# EasyEDA Pro project ProPrj_iamge v2_2026-08-18.epro, board PCB4
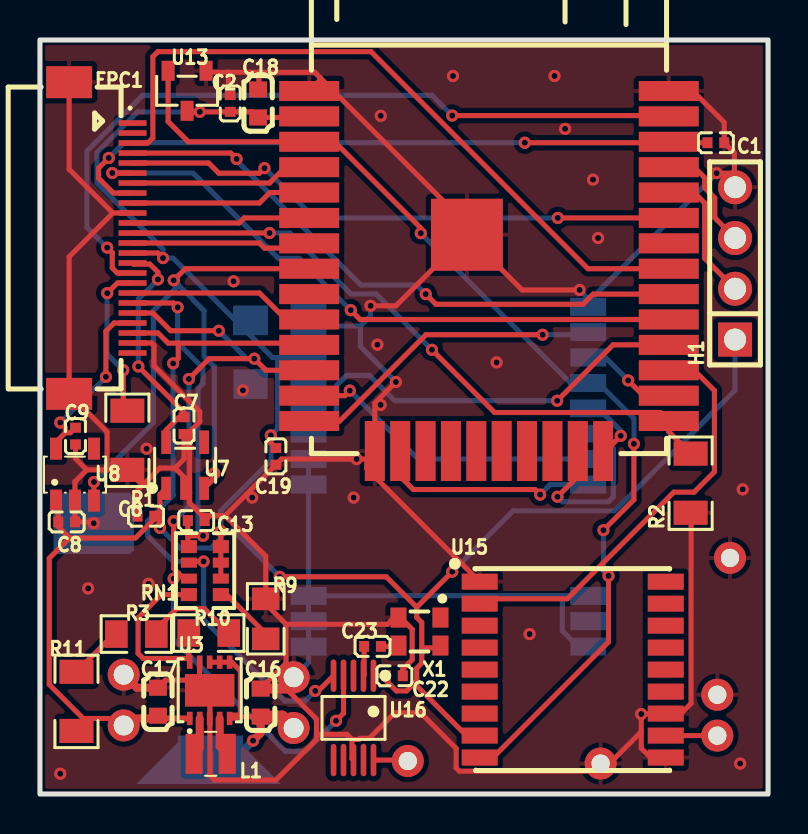
[diagram p2: board, top side]
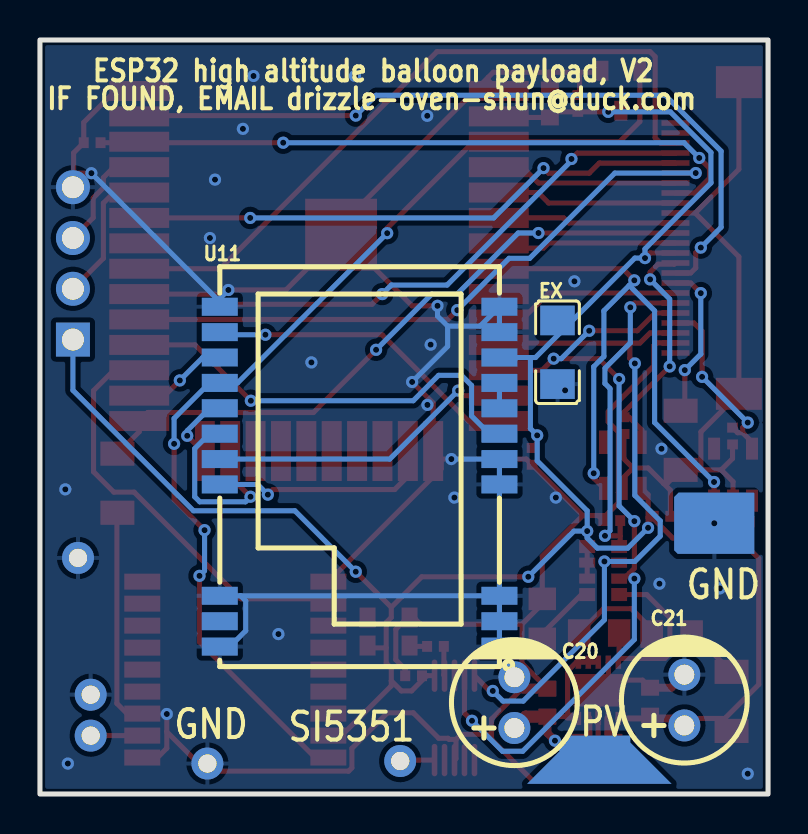
[diagram p3: board, bottom side, seen from below]

Outline 36.45 x 37.72 mm; copper layers: Top Layer, Bottom Layer. Coordinates in mm from the lower left corner of the outline.
Outline path: rectangle 0,37.72 36.45,0
Stack: Top Layer 0.035mm / Dielectric1 1.51mm FR4 er 4.5 / Bottom Layer 0.035mm

## Design rules (mm)
template: JLCPCB Capability(Two Layers Board)
spacing copperThickness1oz (default): track to track 0.102, other pairs 0.152 to 0.3
spacing copperThickness2oz: track to track 0.203, other pairs 0.152 to 0.3
track width copperThickness1oz (default): min 0.127, default 0.254, max 2.54
track width copperThickness2oz: min 0.203, default 0.254, max 2.54
differential pair differentialPair (default): width min 0.127, default 0.254, max 2.54; gap min 0.152, default 0.152
via viaSize (default): diameter min 0.5, default 0.61, max 10; hole min 0.3, default 0.305, max 6.3

## Placement (name value [footprint] x y rotation side)
C1  15pF  [C0402]  33.84 32.58 180 top
C2  100nF  [C0402]  9.53 34.54 270 top
C6  1uF  [C0402]  5.31 13.9 0 top
C7  1uF  [C0402]  7.21 18.43 90 top
C8  1uF  [C0402]  1.34 13.61 180 top
C9  1uF  [C0402]  1.78 17.91 90 top
C13  100nF  [C0402]  7.82 13.68 0 top
C16  10uF  [C0603]  11.05 4.57 270 top
C17  10uF  [C0603]  5.91 4.62 270 top
C18  10uF  [C0603]  10.92 34.54 270 top
C19  1uF  [C0402]  11.81 16.89 270 top
C20  1000uF  [CAP-TH_BD6.3-P2.50-D1.0-FD]  12.7 4.57 90 bottom
C21  1000uF  [CAP-TH_BD6.3-P2.50-D1.0-FD]  4.19 4.7 90 bottom
C22  1uF  [C0402]  17.74 5.92 0 top
C23  100nF  [C0402]  16.65 7.38 180 top
EX  EX  [C1206]  10.54 22.1 270 bottom
FPC1  FH12-24S-0.5SH(55)  [FPC-SMD_FH12-24S-0.5SH-55]  3.05 27.81 90 top
H1  PZ254V-11-04P  [HDR-TH_4P-P2.54-V-M]  34.8 26.54 90 top
L1  4.7uH  [IND-SMD_L2.5-W2.0-VLS252012CX-150M]  8.55 2.01 180 top
NOREF  -  [Pad_e340]  18.41 1.65 0 top
NOREF#2  -  [Pad_e1166]  33.91 2.92 0 top
NOREF#3  -  [Pad_e701]  28.07 1.52 0 top
NOREF#4  -  [Pad_e1167]  33.91 4.97 0 top
NOREF#5  -  [Pad_e1445]  34.54 11.81 0 top
NOREF#6  -  [Pad_e27518]  8.45 1.71 0 top
NOREF#7  -  [Pad_e27528]  2.69 13.54 0 top
R1  1kΩ  [R1206]  4.38 17.69 90 top
R2  1kΩ  [R1206]  32.57 15.55 90 top
R3  16kΩ  [R0805]  4.83 8 180 top
R9  82kΩ  [R0805]  11.3 8.76 90 top
R10  470kΩ  [R0805]  8.45 8.05 0 top
R11  1kΩ  [R1206]  1.83 4.63 270 top
RN1  4.7kΩ  [RES-ARRAY-SMD_0603-8P-L3.2-W1.6-BL]  8.25 11.18 270 top
U1  2.4GHz  [WIRELM-SMD_ESP32-S]  22.48 26.16 0 top
U3  RT6150AGQW  [WDFN-10_L3.0-W3.0-P0.50-BL-EP]  8.5 5.19 0 top
U7  ME6211C12M5G-N  [SOT-23-5_L3.0-W1.7-P0.95-LS2.8-BL]  7.27 16.44 0 top
U8  ME6211C28M5G-N  [SOT-23-5_L3.0-W1.7-P0.95-LS2.8-BR]  1.75 15.98 270 top
U11  E22-900M22S  [WIRELM-SMD_E22-900M22S]  20.45 15.88 180 bottom
U13  MAX809STRG-TP  [SOT-23-3_L2.9-W1.3-P1.90-LS2.4-BR]  7.37 35.18 90 top
U15  ATGM336H-5NR32  [GPS-SMD_18P-L10.1-W9.7-P1.10-TL]  26.67 6.22 0 top
U16  SI5351A-B-GTR  [MSOP-10_L3.0-W3.0-P0.50-LS5.0-BL]  15.7 3.81 180 top
X1  26MHz  [OSC-SMD_4P-L2.5-W2.0-BL_X1G0042110003]  19 8.13 180 top

## Footprints (pads in the part's own frame, mm; a bottom-side part is the same pattern mirrored in y, then rotated)
C0402
  rect 0.5x0.54 smd: 1(-0.42,0) 2(0.42,0)
C0603
  rect 0.8x0.9 smd: 1(-0.7,0) 2(0.7,0)
C1206
  rect 1.485x1.728 smd: 1(-1.593,0) 2(1.593,0)
CAP-TH_BD6.3-P2.50-D1.0-FD
  round 1.6 hole 1: 1(-1.27,0) 2(1.27,0)
FPC-SMD_FH12-24S-0.5SH-55
  rect 0.28x1.4 smd: 1(5.75,-1.588) 2(5.25,-1.588) 3(4.75,-1.588) 4(4.25,-1.588) 5(3.751,-1.588) 6(3.25,-1.588) 7(2.751,-1.588) 8(2.251,-1.588) 9(1.75,-1.588) 10(1.25,-1.588) 11(0.75,-1.588) 12(0.25,-1.588) 13(-0.25,-1.588) 14(-0.75,-1.588) 15(-1.25,-1.588) 16(-1.75,-1.588) 17(-2.25,-1.588) 18(-2.75,-1.588) 19(-3.25,-1.588) 20(-3.75,-1.588) 21(-4.25,-1.588) 22(-4.75,-1.588) 23(-5.25,-1.588) 24(-5.75,-1.588)
  rect 1.6x2.3 smd: 25(7.795,1.588) 26(-7.795,1.588)
GPS-SMD_18P-L10.1-W9.7-P1.10-TL
  rect 1.8x0.8 smd: 1(-4.657,4.4) 2(-4.657,3.3) 3(-4.657,2.2) 4(-4.657,1.1) 5(-4.657,0) 6(-4.657,-1.1) 7(-4.657,-2.2) 8(-4.657,-3.3) 9(-4.657,-4.4) 10(4.657,-4.4) 11(4.657,-3.3) 12(4.657,-2.2) 13(4.657,-1.1) 14(4.657,0) 15(4.657,1.1) 16(4.657,2.2) 17(4.657,3.3) 18(4.657,4.4)
HDR-TH_4P-P2.54-V-M
  rect 1.7x1.7 hole 1.1: 1(-3.81,0)
  round 1.7 hole 1.1: 2(-1.27,0) 3(1.27,0) 4(3.81,0)
IND-SMD_L2.5-W2.0-VLS252012CX-150M
  rect 0.85x2 smd: 1(-0.83,0) 2(0.83,0)
MSOP-10_L3.0-W3.0-P0.50-LS5.0-BL
  oval 0.28x1.62 smd: 1(-1,-2.11) 2(-0.5,-2.11) 3(0,-2.11) 4(0.5,-2.11) 5(1,-2.11) 6(1,2.11) 7(0.5,2.11) 8(0,2.11) 9(-0.5,2.11) 10(-1,2.11)
OSC-SMD_4P-L2.5-W2.0-BL_X1G0042110003
  rect 0.8x1 smd: 1(-1.05,-0.7) 2(1.05,-0.7) 3(1.05,0.7) 4(-1.05,0.7)
Pad_e340
  round 1.6 hole 0.914: 1(0,0)
Pad_e701
  round 1.6 hole 0.914: 1(0,0)
Pad_e1166
  round 1.6 hole 0.914: 1(0,0)
Pad_e1167
  round 1.6 hole 0.914: 2(0,0)
Pad_e1445
  round 1.6 hole 0.914: 2(0,0)
Pad_e27518
  custom 7.239x2.413 smd far side: 41(0,0)
Pad_e27528
  custom 4.014x3.064 smd far side: 42(0,0)
R0805
  rect 1.133x1.377 smd: 1(-1,0) 2(1,0)
R1206
  rect 1.208x1.701 smd: 1(-1.479,0) 2(1.479,0)
RES-ARRAY-SMD_0603-8P-L3.2-W1.6-BL
  rect 0.65x0.8 smd: 1(-1.2,-0.8) 4(1.2,-0.8) 5(1.2,0.8) 8(-1.2,0.8)
  rect 0.5x0.8 smd: 2(-0.4,-0.8) 3(0.4,-0.8) 6(0.4,0.8) 7(-0.4,0.8)
SOT-23-3_L2.9-W1.3-P1.90-LS2.4-BR
  rect 1x0.65 smd: 1(1,-0.95) 2(1,0.95) 3(-1,0)
SOT-23-5_L3.0-W1.7-P0.95-LS2.8-BL
  rect 0.49x1.157 smd: 1(-0.95,-1.153) 2(0,-1.153) 3(0.95,-1.153)
  rect 0.49x1.175 smd: 4(0.95,1.153) 5(-0.95,1.153)
SOT-23-5_L3.0-W1.7-P0.95-LS2.8-BR
  rect 1.1x0.6 smd: 1(1.3,-0.95) 2(1.3,0) 3(1.3,0.95) 4(-1.3,0.95) 5(-1.3,-0.95)
WDFN-10_L3.0-W3.0-P0.50-BL-EP
  rect 0.28x0.665 smd: 1(-1,-1.407) 2(-0.5,-1.407) 3(0,-1.407) 4(0.5,-1.407) 5(1,-1.407) 6(1,1.407) 7(0.5,1.407) 8(0,1.407) 9(-0.5,1.407) 10(-1,1.407)
  rect 2.475x1.625 smd: 11(0,0)
WIRELM-SMD_E22-900M22S
  rect 1.8x0.9 smd: 1(7,-8.5) 2(7,-7.23) 3(7,-5.96) 4(7,-0.39) 5(7,0.88) 6(7,2.15) 7(7,3.42) 8(7,4.69) 9(7,5.96) 10(7,7.23) 11(7,8.5) 12(-7,8.5) 13(-7,7.23) 14(-7,5.96) 15(-7,4.69) 16(-7,3.42) 17(-7,2.15) 18(-7,0.88) 19(-7,-0.39) 20(-7,-5.96) 21(-7,-7.23) 22(-7,-8.5)
WIRELM-SMD_ESP32-S
  rect 3x1 smd: 1(-9,9.005) 2(-9,7.735) 3(-9,6.465) 4(-9,5.195) 5(-9,3.925) 6(-9,2.655) 7(-9,1.385) 8(-9,0.115) 9(-9,-1.155) 10(-9,-2.425) 11(-9,-3.695) 12(-9,-4.965) 13(-9,-6.235) 14(-9,-7.505) 25(9,-7.505) 26(9,-6.235) 27(9,-4.965) 28(9,-3.695) 29(9,-2.425) 30(9,-1.155) 31(9,0.115) 32(9,1.385) 33(9,2.655) 34(9,3.925) 35(9,5.195) 36(9,6.465) 37(9,7.735) 38(9,9.005)
  rect 1x3 smd: 15(-5.715,-9.005) 16(-4.445,-9.005) 17(-3.175,-9.005) 18(-1.905,-9.005) 19(-0.635,-9.005) 20(0.635,-9.005) 21(1.905,-9.005) 22(3.175,-9.005) 23(4.445,-9.005) 24(5.715,-9.005)
  rect 3.6x3.6 smd: 39(-1.105,1.815)

## Nets
As in the schematic, except:
GND: C1.1 C2.1 C6.1 C7.1 C8.1 C9.1 C13.2 C16.1 C17.1 C18.1 C19.2 C20.2 C21.2 C22.2 EX.2 FPC1.10 FPC1.23 FPC1.25 FPC1.26 H1.4 NOREF#3.1 NOREF#4.2 NOREF#5.2 NOREF#7.42 R1.1 R2.1 R9.2 U1.1 U1.15 U1.38 U1.39 U3.3 U3.9 U3.11 U7.2 U8.2 U11.1 U11.2 U11.3 U11.4 U11.5 U11.10 U11.11 U11.12 U11.20 U11.22 U13.1 U15.1 U15.10 U15.12 U16.8 X1.2
GPSANT: NOREF#2.1 U15.11
PV: C16.2 C20.1 NOREF#6.41 U3.5 U3.6 U3.7 U3.8
SI5351A: NOREF.1 U16.10

Pads without a net: FPC1 1 2 24; U1 32; U7 4; U8 4; U15 3 4 5 6 7 13 14 15 16 17 18; U16 3 6 7 9; X1 1

## Via types
v1: diameter 0.61, hole 0.305, Top Layer to Bottom Layer, 78 vias

## Routing (per net, layer and track width the routed paths; a pad name or vN(x,y) marks a point on that pad's centre or on a via; arc(x,y) is an arc through that point)
1.2V: length 11.8
  Top Layer w0.254: v1(5.91,25.74) 5.91,26.1 5.5,26.5 4.69,26.5 FPC1.15 ; 6.32,17.6 6.32,18.21 6.96,18.85 C7.2 7.21,19.1 v1(4.93,21.39)
  Bottom Layer w0.254: v1(5.91,25.74) 4.93,24.76 v1(4.93,21.39)
2.8V: length 9.2
  Top Layer w0.254: 1.27,18.07 1.27,18.33 v1(1.02,18.58) ; 1.27,18.07 1.52,18.07 C9.2 ; 1.27,18.07 0.8,17.61 U8.5 ; v1(3.3,20.87) 3.3,23.15 3.71,23.56 FPC1.21
  Bottom Layer w0.254: v1(1.02,18.58) v1(3.3,20.87)
3.3V: length 119.5
  Top Layer w0.254: 6.01,13.82 6.01,14.98 U7.1 ; 6.01,13.82 5.8,13.82 ; 6.01,13.82 v1(6.01,13.32) ; 5.8,13.82 C6.2 ; 5.8,13.82 4.78,12.81 1.48,12.81 ; U1.2 13.43,33.84 C18.2 10.64,34.12 C2.2 v1(8,34.12) 7.42,34.12 U13.3 ; v1(6.16,26.81) 5.91,27.06 FPC1.14 ; 18.86,5.66 18.86,5.41 21.35,2.92 U15.8 ; 18.86,5.66 18.35,5.16 17.84,5.16 17.08,5.92 ; 18.86,5.66 18.86,6.29 19.12,6.55 19.12,7.31 ; 2.16,3.78 0.47,5.48 0.47,11.79 1.48,12.81 ; 2.16,3.78 2.16,3.49 R11.2 ; 2.16,3.78 4.19,3.78 4.19,3.43 ; v1(11.56,17.94) 11.56,17.56 C19.1 ; RN1.6 RN1.7 RN1.8 v1(9.06,13.15) ; 1.48,12.81 0.92,13.37 C8.2 0.92,14.56 U8.1 ; 18.86,9.34 17.34,10.87 v1(12,10.87) ; 18.86,9.34 v1(20.64,11.12) ; 18.86,9.34 18.86,8.83 19.12,8.58 19.12,7.31 ; 17.08,5.92 C22.1 ; 17.08,5.92 U16.1 ; 5.97,3.78 5.97,3.85 C17.2 ; 19.12,7.31 19.93,7.31 X1.4
  Top Layer w0.3: 5.97,3.78 U3.1
  Top Layer w0.4: 4.19,3.78 5.97,3.78
  Bottom Layer w0.254: v1(8,34.12) 4.89,34.12 2.86,32.09 2.86,30.57 6.16,27.27 v1(6.16,26.81) 6.67,26.81 11.64,21.83 11.9,21.83 ; v1(9.06,13.15) 9.06,14.17 11.56,16.67 v1(11.56,17.94) 11.9,18.28 11.9,21.83 ; v1(9.06,13.15) 9.72,13.15 v1(12,10.87) ; v1(9.06,13.15) 9.06,12.81 8.55,12.3 7.02,12.3 v1(6.01,13.32) ; 11.9,21.83 U11.9 ; H1.1 34.8,20.2 28.77,14.17 23.69,14.17 v1(20.64,11.12)
GND: length 240
  Top Layer w0.254: FPC1.23 5.58,22.56 5.72,22.43 5.72,21.42 8,19.13 8,18.62 7.49,18.11 7.49,15.07 ; U1.1 14.01,35.7 14.01,35.85 ; U13.1 8.39,36.1 9.44,36.1 ; 30.1,3.11 v1(30.1,4) 31.31,4 U15.12 32.09,4.02 32.6,4.53 32.6,14.04 R2.1 ; 30.1,3.11 28.13,1.14 21,1.14 20.83,1.31 20.83,2.28 19.05,4.06 17.76,4.06 16.49,2.79 16.02,2.79 15.97,2.73 15.62,2.73 ; 30.1,3.11 30.1,2.29 30.57,1.82 U15.10 ; 9.27,13.93 11.3,11.9 R9.2 11.3,9.51 12.32,8.49 ; 9.27,13.93 8.51,13.93 ; 9.27,13.93 C19.2 12.09,16.75 v1(15.85,16.75) 16.36,16.75 ; 7.49,15.07 7.49,14.56 8.12,13.93 8.51,13.93 ; 7.49,15.07 U7.2 7.27,15.8 6.76,16.31 ; 12.32,5.27 13.84,3.75 13.84,2.99 ; 13.84,2.99 13.84,2.73 11.81,0.7 8.76,0.7 8.51,0.95 8.51,3.77 ; 13.84,2.99 15.37,2.99 15.62,2.73 ; 8.51,3.77 U3.3 ; 8.51,3.77 8.51,5.17 U3.11 7.99,5.7 ; 14.01,35.85 20.61,29.25 20.61,27.21 ; 14.01,35.85 13.75,36.1 10.96,36.1 ; 3.36,16.21 R1.1 5.04,15.54 5.24,15.54 ; 3.36,16.21 3.36,18.12 FPC1.26 1.46,26.88 3.65,29.06 ; 3.36,16.21 2.34,16.21 ; 5.24,15.54 4.89,15.2 C6.1 ; 5.24,15.54 6,16.31 6.76,16.31 ; 17.87,8.75 17.65,8.75 17.4,8.49 12.32,8.49 ; 17.87,8.75 X1.2 ; 17.87,8.75 18.13,8.75 18.63,8.24 18.63,6.71 18.16,6.24 C22.2 ; 8.51,13.93 C13.2 ; U3.9 7.99,6.59 7.99,5.7 ; C16.1 12.32,6.54 12.32,8.49 ; 1.75,13.61 U8.2 1.75,15.62 2.34,16.21 ; 2.34,16.21 1.78,16.78 C9.1 ; 9.44,36.1 10.96,36.1 ; 9.44,36.1 9.44,35.05 C2.1 ; U1.38 32.69,35.17 34.26,33.6 C1.1 34.76,32.07 34.76,31.06 ; 20.61,27.21 U1.39 24.14,25.21 v1(27.02,25.21) ; 20.61,27.21 17.82,24.42 v1(16.55,24.42) ; 15.62,2.73 15.62,1.77 U16.8 ; 10.96,36.1 10.96,35.28 C18.1 ; 6.76,16.31 7.21,16.76 C7.1 ; C8.1 2.63,13.61 v1(2.69,13.54) ; U15.1 16.36,16.27 16.36,16.75 ; v1(17.82,20.61) 16.76,19.56 U1.15 16.36,16.75 ; 3.65,29.06 FPC1.10 ; 3.65,29.06 1.46,31.25 FPC1.25 ; 7.99,5.7 6.28,5.7 C17.1 ; 34.76,31.06 34.76,30.39 H1.4 ; 34.76,31.06 v1(33.87,31.06)
  Top Layer w0.4: C17.1 4.84,5.32 C21.2
  Top Layer w0.5: C16.1 12.32,5.27
  Bottom Layer w0.254: U11.12 27.52,24.45 27.52,24.71 ; U11.22 26.94,7.38 26.15,8.17 26.15,9.66 26.4,9.91 ; U11.3 U11.4 U11.5 v1(15.85,16.75) ; U11.3 26.4,9.91 ; U11.3 U11.2 U11.1 13.45,6.59 12.7,5.84 ; v1(33.87,31.06) 27.52,24.71 ; 27.52,24.71 v1(27.02,25.21) ; 16.04,23.41 14.42,23.41 U11.11 U11.10 ; 16.04,23.41 16.04,22.39 v1(17.82,20.61) ; 16.04,23.41 16.55,23.91 v1(16.55,24.42) ; 26.4,9.91 U11.20
  vias: v1(1.02,1.02) v1(2.41,10.29) v1(5.33,17.27) v1(5.44,10.52) v1(9.69,25.65) v1(10.16,20.19) v1(10.62,14.83) v1(15.7,14.83) v1(16.89,22.48) v1(17.06,33.93) v1(17.05,19.47) v1(20.68,35.92) v1(22.86,21.59) v1(24.51,8) v1(25.76,35.92) v1(26.29,33.27) v1(27.69,30.73) v1(27.94,27.81) v1(35.05,1.52) v1(35.18,15.24)
CAMPWR: length 31
  Top Layer w0.254: v1(8.73,16.04) 8.73,15.8 U7.3 ; v1(2.7,15.61) 2.7,14.68 ; U1.8 7.28,26.28 v1(6.69,25.7)
  Bottom Layer w0.254: 6.95,25.44 5.68,24.17 5.68,18.58 v1(2.7,15.61) ; 6.95,25.44 v1(6.69,25.7) ; 6.95,25.44 8.22,24.17 8.22,21.89 8.73,21.38 v1(8.73,16.04)
CAMRST: length 16.6
  Top Layer w0.254: 7.4,12.92 v1(8.16,12.92) ; 7.4,12.92 7.4,12.43 7.46,12.38 ; 7.4,12.92 C13.1 ; FPC1.19 6.68,24.56 v1(6.89,24.35)
  Bottom Layer w0.254: v1(6.89,24.35) 6.89,22.57 8.16,21.3 8.16,20.54 7.91,20.28 7.91,13.17 v1(8.16,12.92)
CSID0: length 31.9
  Top Layer w0.254: U1.29 16.03,23.74 v1(15.56,24.2) ; FPC1.6 v1(3.62,31.06)
  Bottom Layer w0.254: v1(3.62,31.06) 7.67,31.06 11.93,26.8 12.97,26.8 v1(15.56,24.2)
CSID1: length 30.2
  Top Layer w0.254: U1.30 27.69,25.01 27.19,24.5 19.82,24.5 v1(19.31,25.01) ; FPC1.4 9.55,32.06 v1(9.84,31.77)
  Bottom Layer w0.254: v1(9.84,31.77) 9.84,31.68 16.07,25.46 18.86,25.46 v1(19.31,25.01)
CSID2: length 35.6
  Top Layer w0.254: FPC1.3 5.4,32.56 5.65,32.82 5.65,36.88 5.91,37.14 16.57,37.14 27.43,26.28 U1.31
CSID3: length 28.2
  Top Layer w0.254: v1(11.24,31.31) 10.99,31.06 8.95,31.06 8.45,31.56 FPC1.5 ; v1(25.92,28.82) U1.33
  Bottom Layer w0.254: v1(25.92,28.82) 13.73,28.82 v1(11.24,31.31)
CSID4: length 9.2
  Top Layer w0.254: FPC1.7 11.49,30.56 12.26,31.33 13.45,31.33 U1.4
CSID5: length 9.1
  Top Layer w0.254: U1.5 11.51,30.09 10.99,29.56 FPC1.9
CSID6: length 8.9
  Top Layer w0.254: U1.6 10.22,28.82 9.97,28.56 FPC1.11
CSID7: length 9
  Top Layer w0.254: FPC1.13 10.99,27.56 11.24,27.31 13.24,27.31 U1.7
CSIHSYNC: length 38.2
  Top Layer w0.254: v1(20.64,33.94) 31.44,33.94 U1.37 ; v1(3.37,27.33) 3.62,27.08 3.62,26.32 3.87,26.06 FPC1.16
  Bottom Layer w0.254: v1(20.64,33.94) 19.62,34.95 5.14,34.95 2.35,32.16 2.35,28.35 v1(3.37,27.33)
CSIMCLK: length 32.8
  Top Layer w0.254: FPC1.12 v1(11.49,28.06) ; R2.2 31.48,18.12 U1.25 31.05,19.08 22.76,19.08 v1(19.62,22.22)
  Bottom Layer w0.254: v1(11.49,28.06) 12.51,28.06 15.56,25.02 16.83,25.02 v1(19.62,22.22)
CSIPCLK: length 33.7
  Top Layer w0.254: 31.64,32.58 U1.36 ; 31.64,32.58 C1.2 ; 31.64,32.58 v1(24.27,32.58) ; v1(3.44,31.82) 2.94,31.31 2.94,30.8 3.67,30.06 FPC1.8
  Bottom Layer w0.254: v1(3.44,31.82) 4.21,32.58 v1(24.27,32.58)
CSIVSYNC: length 9.4
  Top Layer w0.254: FPC1.18 10.99,25.06 12.26,23.79 13.42,23.79 U1.10
EN: length 52.9
  Top Layer w0.254: v1(28.21,13.2) 29.73,14.72 v1(29.73,17.52) ; U15.9 22.68,1.82 28.46,7.61 v1(28.46,10.91) ; v1(19.07,28.05) 19.07,28.31 14.75,32.63 U1.3 7.43,32.63 6.42,33.64 U13.2
  Bottom Layer w0.254: v1(29.73,17.52) 29.73,18.79 27.96,20.56 U11.15 26.56,20.56 v1(19.07,28.05) ; v1(28.21,13.2) 28.21,11.17 v1(28.46,10.91)
GPSANT: length 2.6
  Top Layer w0.254: NOREF#2.1 33.91,2.92 U15.11
GPSTX: length 21.3
  Top Layer w0.254: U1.27 32.75,21.2 33.76,20.18 33.76,16.12 32.75,15.1 31.73,15.1 26.4,9.77 22.26,9.77 U15.2
IO2: length 3.5
  Top Layer w0.254: U1.24 28.31,17.16 v1(29.08,17.92)
  Bottom Layer w0.254: U11.16 27.55,19.19 28.06,19.19 29.08,18.17 v1(29.08,17.92)
IO4: length 4.8
  Top Layer w0.254: U1.26 30.21,19.93 v1(29.45,20.69)
  Bottom Layer w0.254: v1(29.45,20.69) 28.3,21.83 U11.14
IO12: length 15.8
  Top Layer w0.254: U1.14 15,18.66 19.32,22.97 v1(25.16,22.97)
  Bottom Layer w0.254: v1(25.16,22.97) 27.32,22.97 U11.13
IO13: length 11.3
  Top Layer w0.254: v1(25.04,14.98) 24.79,15.23 18.69,15.23 18.03,15.89 U1.16
  Bottom Layer w0.254: U11.19 25.55,15.48 v1(25.04,14.98)
IO14: length 15.5
  Top Layer w0.254: v1(15.51,20.18) 15.26,19.93 U1.13
  Bottom Layer w0.254: U11.18 18.94,16.75 v1(15.51,20.18)
IO15: length 9.7
  Top Layer w0.254: U1.23 26.92,15.89 v1(25.91,14.87)
  Bottom Layer w0.254: v1(25.91,14.87) 26.16,14.62 28.45,14.62 28.7,14.87 28.7,17.28 27.96,18.02 U11.17
IO17: length 21.8
  Top Layer w0.254: U1.28 28.69,22.47 v1(25.89,19.67)
  Bottom Layer w0.254: U11.6 13.57,18.15 14.08,18.15 14.84,18.91 14.84,20.43 15.35,20.94 16.49,20.94 17.76,19.67 v1(25.89,19.67)
PV: length 11.3
  Top Layer w0.254: U3.8 U3.7 U3.6 9.6,6.59 10.03,6.16 10.03,3.87 C16.2
  Top Layer w0.4: C16.2 11.05,3.05 v1(10.67,2.67) ; 10.03,3.87 9.59,3.87
  Top Layer w0.6: C16.2 12.13,3.87 C20.1
  Bottom Layer w0.4: v1(10.67,2.67) 9.72,1.71 NOREF#6.41
SI5351A: length 1.7
  Top Layer w0.254: NOREF.1 18.37,1.7 U16.10
TWISCK: length 41.4
  Top Layer w0.254: 6.95,11.03 v1(6.69,10.78) ; 6.95,11.03 7.2,10.78 7.46,10.78 ; 6.95,11.03 6.69,11.28 v1(6.69,13.65) ; v1(7.46,20.76) 8.47,21.78 v1(10.73,21.78) 11.31,21.2 U1.12 ; v1(8.95,23.17) 6.54,23.17 5.65,24.06 FPC1.20 ; U16.4 15.2,4.04 v1(14.82,3.66)
  Bottom Layer w0.254: v1(10.73,21.78) 10.35,21.78 v1(8.95,23.17) ; v1(6.69,10.78) 6.69,7.73 12.28,2.14 13.3,2.14 v1(14.82,3.66) ; v1(7.46,20.76) 7.46,14.41 v1(6.69,13.65)
TWISDA: length 35.1
  Top Layer w0.254: v1(13.78,5.16) 13.93,5.16 U16.5 ; 7.46,11.58 7.51,11.63 v1(8.19,11.63) ; 6.92,22.55 6.92,21.79 v1(6.67,21.54) ; 6.92,22.55 6.41,22.55 5.91,23.06 FPC1.22 ; 6.92,22.55 13.39,22.55 U1.11
  Bottom Layer w0.254: v1(6.67,21.54) 6.67,14.93 5.4,13.66 5.4,12.9 6.67,11.63 v1(8.19,11.63) 8.19,8.71 12.26,4.65 13.27,4.65 v1(13.78,5.16)
U0RXD: length 6.9
  Top Layer w0.254: H1.2 33.27,26.8 33.27,29.56 32.75,30.09 U1.34
U0TXD: length 5.7
  Top Layer w0.254: H1.3 33.78,28.83 33.78,29.82 33.27,30.32 33.27,30.83 32.75,31.36 U1.35
$1N1695: length 7.8
  Top Layer w0.254: FPC1.17 3.87,25.56 v1(3.37,25.05) ; 4.38,19.17 4.17,19.38 v1(4.17,21.2)
  Bottom Layer w0.254: v1(4.17,21.2) 3.37,22.01 v1(3.37,25.05)
$1N2495: length 8.9
  Top Layer w0.254: R10.1 7.45,6.78 ; 7.45,6.78 5.16,6.78 4.91,7.04 4.91,8.81 6.07,9.98 7.46,9.98 ; 7.45,6.78 U3.10
$1N3016: length 1.9
  Top Layer w0.4: U3.4 9,2.39 L1.1
$1N3080: length 1.9
  Top Layer w0.4: L1.2 8,2.29 U3.2
$1N10358: length 1.3
  Bottom Layer w0.254: U11.7 U11.8
$1N13935: length 3.3
  Top Layer w0.254: R9.1 11.3,8.02 9.34,9.98 RN1.5
$1N14131: length 4.8
  Top Layer w0.254: R10.2 8.23,9.27 6.84,9.27 5.83,8.25 R3.1
$1N14210: length 2.8
  Top Layer w0.254: R11.1 3.72,8 R3.2
$1N18901: length 1.5
  Top Layer w0.254: U16.2 16.23,5.95 C23.2
$1N18905: length 0.9
  Top Layer w0.254: X1.3 17.91,7.38 17.07,7.38

## Copper pours and planes (outline as drawn; the poured copper is in the pictures)
GND on Top Layer: -3.05,40.77 38.61,40.77 38.61,-1.91 -3.05,-1.91
GND on Bottom Layer: -4.19,42.29 40.26,42.29 40.26,-3.56 -4.19,-3.56

## Text on the board
Bottom Silkscreen Layer: ESP32 high altitude balloon payload, V2 | IF FOUND, EMAIL drizzle-oven-shun@duck.com | GND | PV | SI5351
